# Altium schematic sheet Programmer.SchDoc
size A
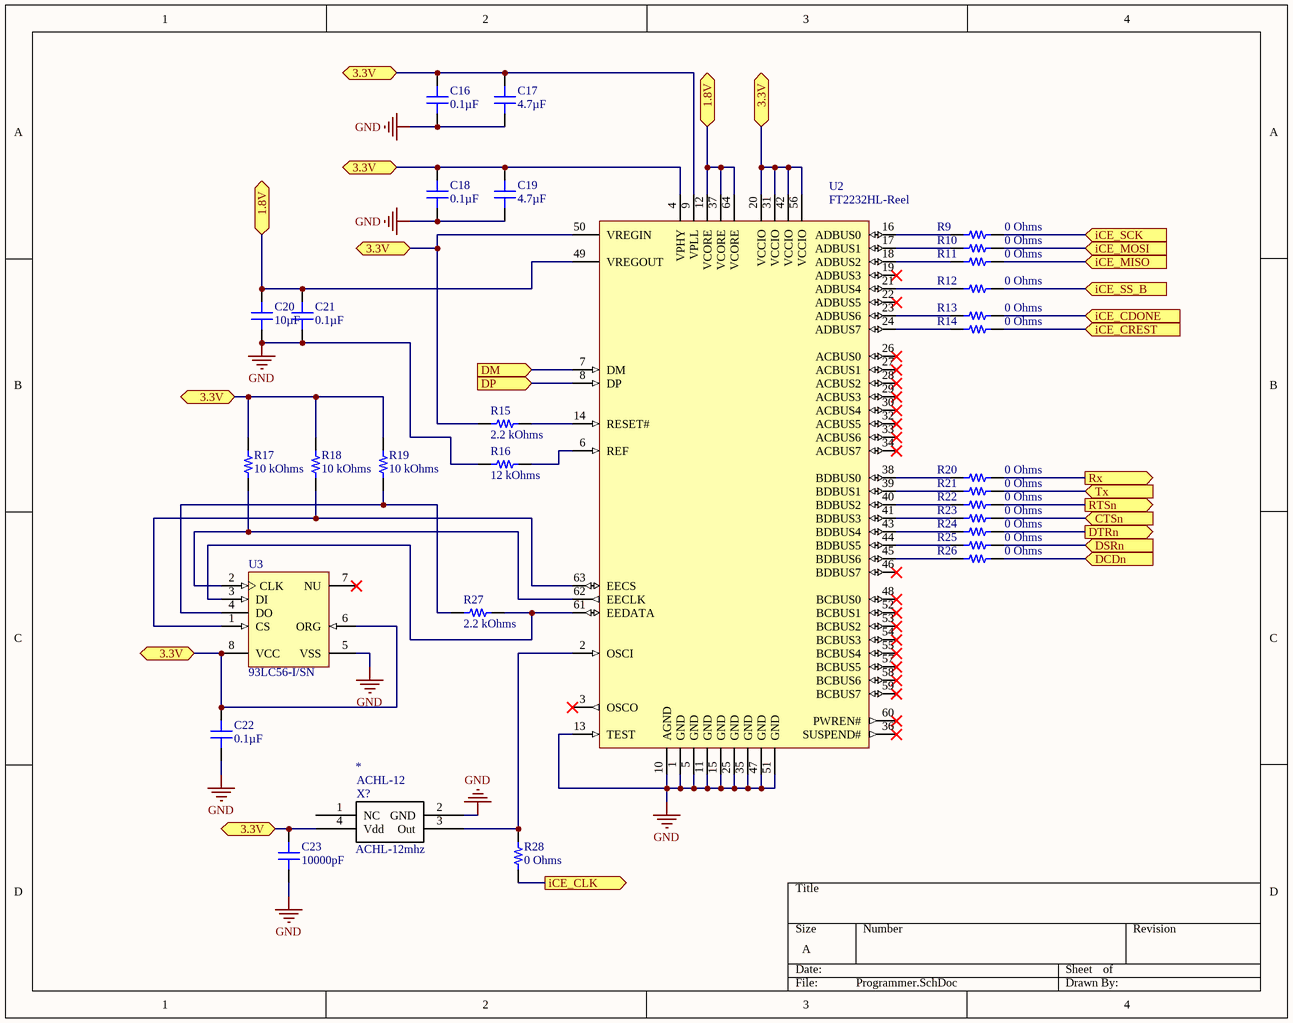
[diagram p0: Programmer.SchDoc]

## Parts
*  ACHL-12mhz  [ACHL-12mhz]
C16  0.1µF  [CAP 0805_2012]
C17  4.7µF  [CAP 0805_2012]
C18  0.1µF  [CAP 0805_2012]
C19  4.7µF  [CAP 0805_2012]
C20  10µF  [CAP 0805_2012]
C21  0.1µF  [CAP 0805_2012]
C22  0.1µF  [CAP 0805_2012]
C23  10000pF  [CAP 0805_2012]
R9  0 Ohms  [RES 0805_2012]
R10  0 Ohms  [RES 0805_2012]
R11  0 Ohms  [RES 0805_2012]
R12  0 Ohms  [RES 0805_2012]
R13  0 Ohms  [RES 0805_2012]
R14  0 Ohms  [RES 0805_2012]
R15  2.2 kOhms  [RES 0805_2012]
R16  12 kOhms  [RES 0805_2012]
R17  10 kOhms  [RES 0805_2012]
R18  10 kOhms  [RES 0805_2012]
R19  10 kOhms  [RES 0805_2012]
R20  0 Ohms  [RES 0805_2012]
R21  0 Ohms  [RES 0805_2012]
R22  0 Ohms  [RES 0805_2012]
R23  0 Ohms  [RES 0805_2012]
R24  0 Ohms  [RES 0805_2012]
R25  0 Ohms  [RES 0805_2012]
R26  0 Ohms  [RES 0805_2012]
R27  2.2 kOhms  [RES 0805_2012]
R28  0 Ohms  [RES 0805_2012]
U2  FT2232HL-Reel  [LQFP-64_M]
U3  93LC56-I/SN  [MCHP-SOIC-SN8_N]

## Ports
1.8V (bidir), 3.3V (bidir), CTSn (in), DCDn (in), DM (in), DP (in), DSRn (in), DTRn (out), iCE_CDONE (in), iCE_CLK (out), iCE_CREST (in), iCE_MISO (in), iCE_MOSI (in), iCE_SCK (in), iCE_SS_B (in), RTSn (out), Rx (out), Tx (in)

## Nets
GND: *.2(GND) C16.1 C17.1 C18.1 C19.1 C20.1 C21.1 C22.1 C23.1 R16.1 U2.1(GND) U2.5(GND) U2.10(AGND) U2.11(GND) U2.13(TEST) U2.15(GND) U2.25(GND) U2.35(GND) U2.47(GND) U2.51(GND) U3.5(VSS)
1.8V: C20.2 C21.2 U2.12(VCORE) U2.37(VCORE) U2.49(VREGOUT) U2.64(VCORE) ; port 1.8V
3.3V: *.4(Vdd) C16.2 C17.2 C18.2 C19.2 C22.2 C23.2 R15.1 R17.2 R18.2 R19.2 U2.4(VPHY) U2.9(VPLL) U2.20(VCCIO) U2.31(VCCIO) U2.42(VCCIO) U2.50(VREGIN) U2.56(VCCIO) U3.6(ORG) U3.8(VCC) ; port 3.3V
CTSn: R23.1 ; port CTSn
DCDn: R26.1 ; port DCDn
DM: U2.7(DM) ; port DM
DP: U2.8(DP) ; port DP
DSRn: R25.1 ; port DSRn
DTRn: R24.1 ; port DTRn
iCE_CDONE: R13.1 ; port iCE_CDONE
iCE_CLK: R28.1 ; port iCE_CLK
iCE_CREST: R14.1 ; port iCE_CREST
iCE_MISO: R11.1 ; port iCE_MISO
iCE_MOSI: R10.1 ; port iCE_MOSI
iCE_SCK: R9.1 ; port iCE_SCK
iCE_SS_B: R12.1 ; port iCE_SS_B
RTSn: R22.1 ; port RTSn
Rx: R20.1 ; port Rx
Tx: R21.1 ; port Tx
Net*_3: *.3(Out) R28.2 U2.2(OSCI)
NetR9_2: R9.2 U2.16(ADBUS0)
NetR10_2: R10.2 U2.17(ADBUS1)
NetR11_2: R11.2 U2.18(ADBUS2)
NetR12_2: R12.2 U2.21(ADBUS4)
NetR13_2: R13.2 U2.23(ADBUS6)
NetR14_2: R14.2 U2.24(ADBUS7)
NetR15_2: R15.2 U2.14(RESET#)
NetR16_2: R16.2 U2.6(REF)
NetR17_1: R17.1 U2.62(EECLK) U3.2(CLK)
NetR18_1: R18.1 U2.63(EECS) U3.1(CS)
NetR19_1: R19.1 R27.1 U3.4(DO)
NetR20_2: R20.2 U2.38(BDBUS0)
NetR21_2: R21.2 U2.39(BDBUS1)
NetR22_2: R22.2 U2.40(BDBUS2)
NetR23_2: R23.2 U2.41(BDBUS3)
NetR24_2: R24.2 U2.43(BDBUS4)
NetR25_2: R25.2 U2.44(BDBUS5)
NetR26_2: R26.2 U2.45(BDBUS6)
NetR27_2: R27.2 U2.61(EEDATA) U3.3(DI)

Not connected (* = marked no-connect by the designer): * 1(NC); U2 3(OSCO)* 19(ADBUS3)* 22(ADBUS5)* 26(ACBUS0)* 27(ACBUS1)* 28(ACBUS2)* 29(ACBUS3)* 30(ACBUS4)* 32(ACBUS5)* 33(ACBUS6)* 34(ACBUS7)* 36(SUSPEND#)* 46(BDBUS7)* 48(BCBUS0)* 52(BCBUS1)* 53(BCBUS2)* 54(BCBUS3)* 55(BCBUS4)* 57(BCBUS5)* 58(BCBUS6)* 59(BCBUS7)* 60(PWREN#)*; U3 7(NU)*

## Notes on the sheet
- (in symbol ACHL-12mhz) ACHL-12; X?

## Library data of the parts
C16 C18 C21 C22 = CL21B104KBCNNNC: CAP CER 0.1UF 50V X7R 0805; Manufacturer: Samsung Electro-Mechanics; Tolerance: ±10%; Part Number: CL21B104KBCNNNC; Value: 0.1µF; Applications: General Purpose; Capacitance: 0.1µF; ComponentLink1Description: Datasheet; ComponentLink1URL: http://www.samsungsem.com/kr/support/product-search/mlcc/CL21B104KBCNNNC.jsp; ComponentLink2Description: DigiKey Link; ComponentLink2URL: http://digikey.com/product-detail/en/samsung-electro-mechanics/CL21B104KBCNNNC/1276-1003-1-ND/3889089; Device Package: 0805 (2012 Metric); LastUpdated: 9/2/2020 1:04:35 AM; Lifecycle Status: Active; Minimum Order: 1; Mounting Type: Surface Mount, MLCC; Operating Temperature: -55°C ~ 125°C; Package / Case: 0805 (2012 Metric); Packaging: TapeAndReel; PartId: 6201; Part Status: Active; Price: 0.01; Series: CL; Size / Dimension: 0.079" L x 0.049" W (2.00mm x 1.25mm); Supplier 1: DigiKey; Supplier Part Number 1: 1276-1003-1-ND; Temperature Coefficient: X7R; Thickness (Max): 0.037" (0.95mm); Voltage - Rated: 50V
C17 C19 = CL21A475KAQNNNE: CAP CER 4.7UF 25V X5R 0805; Manufacturer: Samsung Electro-Mechanics; Tolerance: ±10%; Part Number: CL21A475KAQNNNE; Value: 4.7µF; Applications: General Purpose; Capacitance: 4.7µF; ComponentLink1Description: Datasheet; ComponentLink1URL: http://www.samsungsem.com/kr/support/product-search/mlcc/CL21A475KAQNNNE.jsp; ComponentLink2Description: DigiKey Link; ComponentLink2URL: http://digikey.com/product-detail/en/samsung-electro-mechanics/CL21A475KAQNNNE/1276-1244-1-ND/3889330; Device Package: 0805 (2012 Metric); LastUpdated: 9/2/2020 1:04:19 AM; Lifecycle Status: Active; Minimum Order: 1; Mounting Type: Surface Mount, MLCC; Operating Temperature: -55°C ~ 85°C; Package / Case: 0805 (2012 Metric); Packaging: TapeAndReel; PartId: 14321; Part Status: Active; Price: 0.03; Series: CL; Size / Dimension: 0.079" L x 0.049" W (2.00mm x 1.25mm); Supplier 1: DigiKey; Supplier Part Number 1: 1276-1244-1-ND; Temperature Coefficient: X5R; Thickness (Max): 0.055" (1.40mm); Voltage - Rated: 25V
C20 = CL21A106KOQNNNG: CAP CER 10UF 16V X5R 0805; Manufacturer: Samsung Electro-Mechanics; Tolerance: ±10%; Part Number: CL21A106KOQNNNG; Value: 10µF; Applications: General Purpose; Capacitance: 10µF; ComponentLink1Description: Datasheet; ComponentLink1URL: http://www.samsungsem.com/kr/support/product-search/mlcc/CL21A106KOQNNNG.jsp; ComponentLink2Description: DigiKey Link; ComponentLink2URL: http://digikey.com/product-detail/en/samsung-electro-mechanics/CL21A106KOQNNNG/1276-6455-1-ND/5958083; Device Package: 0805 (2012 Metric); LastUpdated: 9/2/2020 1:04:35 AM; Lifecycle Status: Active; Minimum Order: 1; Mounting Type: Surface Mount, MLCC; Operating Temperature: -55°C ~ 85°C; Package / Case: 0805 (2012 Metric); Packaging: TapeAndReel; PartId: 6236; Part Status: Active; Price: 0.02; Series: CL; Size / Dimension: 0.079" L x 0.049" W (2.00mm x 1.25mm); Supplier 1: DigiKey; Supplier Part Number 1: 1276-6455-1-ND; Temperature Coefficient: X5R; Thickness (Max): 0.055" (1.40mm); Voltage - Rated: 16V
C23 = CL21B103KBANNNC: CAP CER 10000PF 50V X7R 0805; Manufacturer: Samsung Electro-Mechanics; Tolerance: ±10%; Part Number: CL21B103KBANNNC; Value: 10000pF; Applications: General Purpose; Capacitance: 10000pF; ComponentLink1Description: Datasheet; ComponentLink1URL: http://www.samsungsem.com/kr/support/product-search/mlcc/CL21B103KBANNNC.jsp; ComponentLink2Description: DigiKey Link; ComponentLink2URL: http://digikey.com/product-detail/en/samsung-electro-mechanics/CL21B103KBANNNC/1276-1015-1-ND/3889101; Device Package: 0805 (2012 Metric); LastUpdated: 9/2/2020 1:04:35 AM; Lifecycle Status: Active; Minimum Order: 1; Mounting Type: Surface Mount, MLCC; Operating Temperature: -55°C ~ 125°C; Package / Case: 0805 (2012 Metric); Packaging: TapeAndReel; PartId: 6199; Part Status: Active; Price: 0.01; Series: CL; Size / Dimension: 0.079" L x 0.049" W (2.00mm x 1.25mm); Supplier 1: DigiKey; Supplier Part Number 1: 1276-1015-1-ND; Temperature Coefficient: X7R; Thickness (Max): 0.030" (0.75mm); Voltage - Rated: 50V
R9-R14 R20-R26 R28 = RMCF0805ZT0R00: RES 0 OHM JUMPER 1/8W 0805; Manufacturer: Stackpole Electronics Inc; Power (Watts): 0.125W, 1/8W; Part Number: RMCF0805ZT0R00; Value: 0 Ohms; ComponentLink1Description: Datasheet; ComponentLink1URL: https://www.seielect.com/catalog/sei-packaging.pdf; ComponentLink2Description: DigiKey Link; ComponentLink2URL: http://digikey.com/product-detail/en/stackpole-electronics-inc/RMCF0805ZT0R00/RMCF0805ZT0R00CT-ND/1942606; Composition: Thick Film; Device Package: 0805 (2012 Metric); Features: Automotive AEC-Q200; Height - Seated (Max): 0.026" (0.65mm); LastUpdated: 9/2/2020 1:14:43 AM; Lifecycle Status: Active; Minimum Order: 1; Number of Terminations: 2; Operating Temperature: -55°C ~ 155°C; Package / Case: 0805 (2012 Metric); Packaging: CutTape; PartId: 46079; Part Status: Active; Price: 0.10; Ratings: AEC-Q200; Resistance: 0 Ohms; Series: RMCF; Size / Dimension: 0.079" L x 0.049" W (2.00mm x 1.25mm); Supplier 1: DigiKey; Supplier Part Number 1: RMCF0805ZT0R00CT-ND; Supplier Device Package: 0805; Tolerance: Jumper
R15 R27 = ESR10EZPJ222: RES SMD 2.2K OHM 5% 0.4W 0805; Manufacturer: Rohm Semiconductor; Power (Watts): 0.4W, 2/5W; Temperature Coefficient: ±200ppm/°C; Part Number: ESR10EZPJ222; Value: 2.2 kOhms; ComponentLink1Description: Datasheet; ComponentLink1URL: https://www.rohm.com/datasheet/ESR01MZPF/esr-e; ComponentLink2Description: DigiKey Link; ComponentLink2URL: http://digikey.com/product-detail/en/rohm-semiconductor/ESR10EZPJ222/RHM2.2KKCT-ND/1762991; Composition: Thick Film; Device Package: 0805 (2012 Metric); Features: Automotive AEC-Q200, Pulse Withstanding; Height - Seated (Max): 0.026" (0.65mm); LastUpdated: 9/2/2020 1:15:14 AM; Lifecycle Status: Active; Minimum Order: 1; Number of Terminations: 2; Operating Temperature: -55°C ~ 155°C; Package / Case: 0805 (2012 Metric); Packaging: TapeAndReel; PartId: 32275; Part Status: Active; Price: 0.01; Ratings: AEC-Q200; Resistance: 2.2 kOhms; Series: ESR; Size / Dimension: 0.079" L x 0.049" W (2.00mm x 1.25mm); Supplier 1: DigiKey; Supplier Part Number 1: RHM2.2KKCT-ND; Supplier Device Package: 0805; Tolerance: ±5%
R16 = CRG0805F12K: RES SMD 12K OHM 1% 1/8W 0805; Manufacturer: TE Connectivity Passive Product; Power (Watts): 0.125W, 1/8W; Temperature Coefficient: ±100ppm/°C; Part Number: CRG0805F12K; Value: 12 kOhms; ComponentLink1Description: Datasheet; ComponentLink1URL: https://www.te.com/commerce/DocumentDelivery/DDEController?Action=srchrtrv&DocNm=1773204&DocType=DS&DocLang=English; ComponentLink2Description: DigiKey Link; ComponentLink2URL: http://digikey.com/product-detail/en/te-connectivity-passive-product/CRG0805F12K/A126337CT-ND/7603392; Composition: Thick Film; Device Package: 0805 (2012 Metric); Height - Seated (Max): 0.026" (0.65mm); LastUpdated: 9/2/2020 1:14:43 AM; Lifecycle Status: Active; Minimum Order: 1; Number of Terminations: 2; Operating Temperature: -55°C ~ 155°C; Package / Case: 0805 (2012 Metric); Packaging: TapeAndReel; PartId: 46149; Part Status: Active; Price: 0.01; Resistance: 12 kOhms; Series: CRG, Neohm; Size / Dimension: 0.079" L x 0.049" W (2.00mm x 1.25mm); Supplier 1: DigiKey; Supplier Part Number 1: A126337CT-ND; Supplier Device Package: 0805; Tolerance: ±1%
R17-R19 = RNCP0805FTD10K0: RES 10K OHM 1% 1/4W 0805; Manufacturer: Stackpole Electronics Inc; Power (Watts): 0.25W, 1/4W; Temperature Coefficient: ±100ppm/°C; Part Number: RNCP0805FTD10K0; Value: 10 kOhms; ComponentLink1Description: Datasheet; ComponentLink1URL: https://www.seielect.com/catalog/sei-rncp.pdf; ComponentLink2Description: DigiKey Link; ComponentLink2URL: http://digikey.com/product-detail/en/stackpole-electronics-inc/RNCP0805FTD10K0/RNCP0805FTD10K0CT-ND/2240601; Composition: Thin Film; Device Package: 0805 (2012 Metric); Features: Anti-Sulfur, Moisture Resistant; Height - Seated (Max): 0.024" (0.60mm); LastUpdated: 9/2/2020 1:15:23 AM; Lifecycle Status: Active; Minimum Order: 1; Number of Terminations: 2; Operating Temperature: -55°C ~ 155°C; Package / Case: 0805 (2012 Metric); Packaging: TapeAndReel; PartId: 28021; Part Status: Active; Price: 0.01; Resistance: 10 kOhms; Series: RNCP; Size / Dimension: 0.079" L x 0.049" W (2.00mm x 1.25mm); Supplier 1: DigiKey; Supplier Part Number 1: RNCP0805FTD10K0CT-ND; Supplier Device Package: 0805; Tolerance: ±1%
U2 = CMP-0078-00023-3: Dual High Speed USB To Multipurpose UART/FIFO IC, 64-pin LQFP, Tape and Reel; Manufacturer: FTDI; DatasheetVersion: ver 2.21, Jun-2012; ComponentLink1URL: http://www.ftdichip.com/; PartNumber: FT2232HL-Reel; ComponentLink2Description: Datasheet; RevisionNote: DatasheetVersion updated to 2.21 Jun-2012; PackageVersion: Jun-12; ComponentLink1Description: Manufacturer URL; ComponentLink2URL: http://www.ftdichip.com/Support/Documents/DataSheets/ICs/DS_FT2232H.pdf; PackageReference: LQFP-64; PackageDescription: 64-Pin Thin Quad Flat Pack, 10 x 10 x 1.4 mm Body, 0.5 mm Pitch
U3 = CMP-0162-00635-1: 2K bits Microwire Serial EEPROM, 2.5 to 5.5 V, 2 MHz, -40 to 85 degC, 8-pin SOIC (SN8), Tube; Manufacturer: Microchip; PartNumber: 93LC56-I/SN; ComponentLink1Description: Manufacturer URL; ComponentLink3Description: Package Specification; ComponentLink4URL: http://www.microchip.com/93LC56; ComponentLink2URL: http://ww1.microchip.com/downloads/en/DeviceDoc/21712B.pdf; ComponentLink1URL: http://www.microchip.com; Mounting Technology: Surface Mount; ComponentLink3URL: http://www.microchip.com/stellent/groups/techpub_sg/documents/packagingspec/en012702.pdf; PackageVersion: C04-057C; DatasheetVersion: Rev. B; ComponentLink2Description: Datasheet; PackageDescription: 8-Lead Plastic Small Outline, 4.9 x 3.9 mm Body, 1.27 mm Pitch; PackageReference: SOIC-SN8; ComponentLink4Description: Product URL